# Altium schematic sheet Half_Bridges.SchDoc
size B; DocumentNumber: 6; SheetNumber: 7; SheetTotal: 7
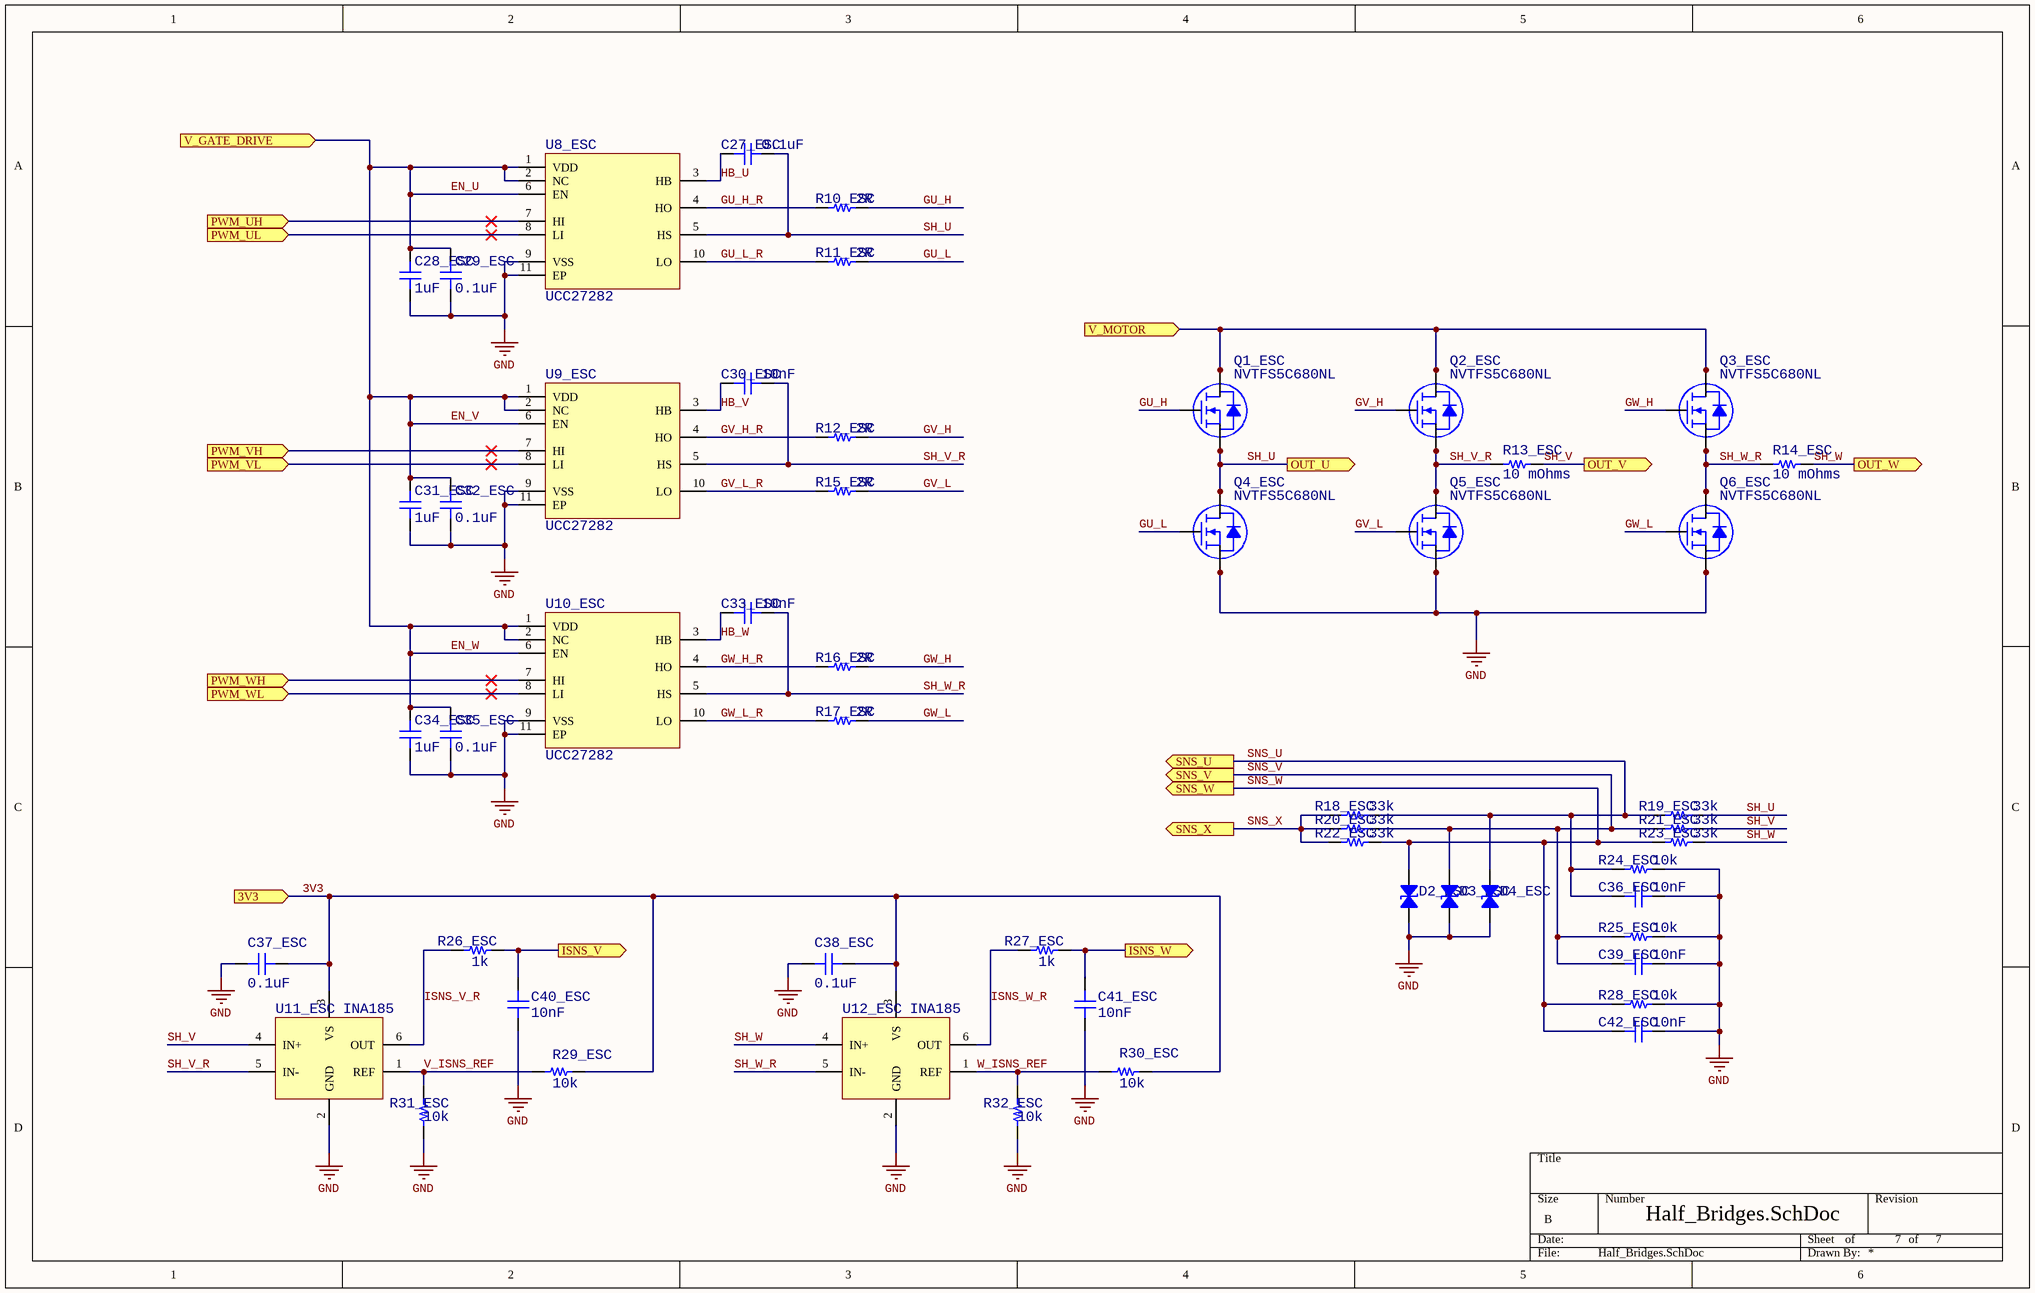
[diagram p0: Half_Bridges.SchDoc]

## Parts
C27_ESC  0.1uF  [CAP_0402]
C28_ESC  1uF  [CAP_0402]
C29_ESC  0.1uF  [CAP_0402]
C30_ESC  10nF  [CAP_0402]
C31_ESC  1uF  [CAP_0402]
C32_ESC  0.1uF  [CAP_0402]
C33_ESC  10nF  [CAP_0402]
C34_ESC  1uF  [CAP_0402]
C35_ESC  0.1uF  [CAP_0402]
C36_ESC  10nF  [CAP_0402]
C37_ESC  0.1uF  [CAP_0402]
C38_ESC  0.1uF  [CAP_0402]
C39_ESC  10nF  [CAP_0402]
C40_ESC  10nF  [CAP_0402]
C41_ESC  10nF  [CAP_0402]
C42_ESC  10nF  [CAP_0402]
D2_ESC  TVN3V3B1S-DFN1006-2LDG  [0402]  (value not drawn)
D3_ESC  TVN3V3B1S-DFN1006-2LDG  [0402]  (value not drawn)
D4_ESC  TVN3V3B1S-DFN1006-2LDG  [0402]  (value not drawn)
Q1_ESC  NVTFS5C680NL  [NVTFS015N04CTAG]
Q2_ESC  NVTFS5C680NL  [NVTFS015N04CTAG]
Q3_ESC  NVTFS5C680NL  [NVTFS015N04CTAG]
Q4_ESC  NVTFS5C680NL  [NVTFS015N04CTAG]
Q5_ESC  NVTFS5C680NL  [NVTFS015N04CTAG]
Q6_ESC  NVTFS5C680NL  [NVTFS015N04CTAG]
R10_ESC  2R  [RES_0402]
R11_ESC  2R  [RES_0402]
R12_ESC  2R  [RES_0402]
R13_ESC  10 mOhms  [RES 1206_3216]
R14_ESC  10 mOhms  [RES 1206_3216]
R15_ESC  2R  [RES_0402]
R16_ESC  2R  [RES_0402]
R17_ESC  2R  [RES_0402]
R18_ESC  33k  [RES_0402]
R19_ESC  33k  [RES_0402]
R20_ESC  33k  [RES_0402]
R21_ESC  33k  [RES_0402]
R22_ESC  33k  [RES_0402]
R23_ESC  33k  [RES_0402]
R24_ESC  10k  [RES_0402]
R25_ESC  10k  [RES_0402]
R26_ESC  1k  [RES_0402]
R27_ESC  1k  [RES_0402]
R28_ESC  10k  [RES_0402]
R29_ESC  10k  [RES_0402]
R30_ESC  10k  [RES_0402]
R31_ESC  10k  [RES_0402]
R32_ESC  10k  [RES_0402]
U8_ESC  UCC27282  [VSON-10]
U9_ESC  UCC27282  [VSON-10]
U10_ESC  UCC27282  [VSON-10]
U11_ESC  INA185  [TI SC70-6 DCK]
U12_ESC  INA185  [TI SC70-6 DCK]

## Ports
3V3 (in), ISNS_V (out), ISNS_W (out), OUT_U (out), OUT_V (out), OUT_W (out), PWM_UH (in), PWM_UL (in), PWM_VH (in), PWM_VL (in), PWM_WH (in), PWM_WL (in), SNS_U (out), SNS_V (out), SNS_W (out), SNS_X (out), V_GATE_DRIVE (in), V_MOTOR (in)

## Nets
GND: C28_ESC.2 C29_ESC.2 C31_ESC.2 C32_ESC.2 C34_ESC.2 C35_ESC.2 C36_ESC.1 C37_ESC.2 C38_ESC.2 C39_ESC.1 C40_ESC.2 C41_ESC.2 C42_ESC.1 D2_ESC.1 D3_ESC.1 D4_ESC.1 Q4_ESC.1(S) Q4_ESC.2(S) Q4_ESC.3(S) Q5_ESC.1(S) Q5_ESC.2(S) Q5_ESC.3(S) Q6_ESC.1(S) Q6_ESC.2(S) Q6_ESC.3(S) R24_ESC.2 R25_ESC.2 R28_ESC.2 R31_ESC.2 R32_ESC.2 U8_ESC.9(VSS) U8_ESC.11(EP) U9_ESC.9(VSS) U9_ESC.11(EP) U10_ESC.9(VSS) U10_ESC.11(EP) U11_ESC.2(GND) U12_ESC.2(GND)
3V3: C37_ESC.1 C38_ESC.1 R29_ESC.1 R30_ESC.1 U11_ESC.3(VS) U12_ESC.3(VS) ; port 3V3
EN_U: C28_ESC.1 C29_ESC.1 C31_ESC.1 C32_ESC.1 C34_ESC.1 C35_ESC.1 U8_ESC.1(VDD) U8_ESC.2(NC) U8_ESC.6(EN) U9_ESC.1(VDD) U9_ESC.2(NC) U9_ESC.6(EN) U10_ESC.1(VDD) U10_ESC.2(NC) U10_ESC.6(EN) ; port V_GATE_DRIVE  [also labelled EN_V, EN_W]
GU_H: Q1_ESC.4(G) R10_ESC.2
GU_H_R: R10_ESC.1 U8_ESC.4(HO)
GU_L: Q4_ESC.4(G) R11_ESC.2
GU_L_R: R11_ESC.1 U8_ESC.10(LO)
GV_H: Q2_ESC.4(G) R12_ESC.2
GV_H_R: R12_ESC.1 U9_ESC.4(HO)
GV_L: Q5_ESC.4(G) R15_ESC.2
GV_L_R: R15_ESC.1 U9_ESC.10(LO)
GW_H: Q3_ESC.4(G) R16_ESC.2
GW_H_R: R16_ESC.1 U10_ESC.4(HO)
GW_L: Q6_ESC.4(G) R17_ESC.2
GW_L_R: R17_ESC.1 U10_ESC.10(LO)
HB_U: C27_ESC.2 U8_ESC.3(HB)
HB_V: C30_ESC.2 U9_ESC.3(HB)
HB_W: C33_ESC.2 U10_ESC.3(HB)
ISNS_V: C40_ESC.1 R26_ESC.1 ; port ISNS_V
ISNS_V_R: R26_ESC.2 U11_ESC.6(OUT)
ISNS_W: C41_ESC.1 R27_ESC.1 ; port ISNS_W
ISNS_W_R: R27_ESC.2 U12_ESC.6(OUT)
PWM_UH: U8_ESC.7(HI) ; port PWM_UH
PWM_UL: U8_ESC.8(LI) ; port PWM_UL
PWM_VH: U9_ESC.7(HI) ; port PWM_VH
PWM_VL: U9_ESC.8(LI) ; port PWM_VL
PWM_WH: U10_ESC.7(HI) ; port PWM_WH
PWM_WL: U10_ESC.8(LI) ; port PWM_WL
SH_U: C27_ESC.1 Q1_ESC.1(S) Q1_ESC.2(S) Q1_ESC.3(S) Q4_ESC.5(D) Q4_ESC.6(D) Q4_ESC.7(D) Q4_ESC.8(D) R19_ESC.1 U8_ESC.5(HS) ; port OUT_U
SH_V: R13_ESC.2 R21_ESC.1 U11_ESC.4(IN+) ; port OUT_V
SH_V_R: C30_ESC.1 Q2_ESC.1(S) Q2_ESC.2(S) Q2_ESC.3(S) Q5_ESC.5(D) Q5_ESC.6(D) Q5_ESC.7(D) Q5_ESC.8(D) R13_ESC.1 U9_ESC.5(HS) U11_ESC.5(IN-)
SH_W: R14_ESC.2 R23_ESC.1 U12_ESC.4(IN+) ; port OUT_W
SH_W_R: C33_ESC.1 Q3_ESC.1(S) Q3_ESC.2(S) Q3_ESC.3(S) Q6_ESC.5(D) Q6_ESC.6(D) Q6_ESC.7(D) Q6_ESC.8(D) R14_ESC.1 U10_ESC.5(HS) U12_ESC.5(IN-)
SNS_U: C36_ESC.2 D4_ESC.2 R18_ESC.1 R19_ESC.2 R24_ESC.1 ; port SNS_U
SNS_V: C39_ESC.2 D3_ESC.2 R20_ESC.1 R21_ESC.2 R25_ESC.1 ; port SNS_V
SNS_W: C42_ESC.2 D2_ESC.2 R22_ESC.1 R23_ESC.2 R28_ESC.1 ; port SNS_W
SNS_X: R18_ESC.2 R20_ESC.2 R22_ESC.2 ; port SNS_X
V_ISNS_REF: R29_ESC.2 R31_ESC.1 U11_ESC.1(REF)
V_MOTOR: Q1_ESC.5(D) Q1_ESC.6(D) Q1_ESC.7(D) Q1_ESC.8(D) Q2_ESC.5(D) Q2_ESC.6(D) Q2_ESC.7(D) Q2_ESC.8(D) Q3_ESC.5(D) Q3_ESC.6(D) Q3_ESC.7(D) Q3_ESC.8(D) ; port V_MOTOR
W_ISNS_REF: R30_ESC.2 R32_ESC.1 U12_ESC.1(REF)

## Notes on the sheet
- of

## Library data of the parts
C27_ESC C28_ESC C29_ESC C30_ESC C31_ESC C32_ESC C33_ESC C34_ESC C35_ESC C36_ESC C37_ESC C38_ESC C39_ESC C40_ESC C41_ESC C42_ESC = CAP_0402: CAP CER 402
  C27_ESC C29_ESC C32_ESC C35_ESC C37_ESC C38_ESC: Value: 0.1uF
  C28_ESC C31_ESC C34_ESC: Value: 1uF
  C30_ESC C33_ESC C36_ESC C39_ESC C40_ESC C41_ESC C42_ESC: Value: 10nF
D2_ESC D3_ESC D4_ESC = TVN3V3B1S-DFN1006-2LDG: TVS DIODE 3.3V 14.2PF DFN1006; Manufacturer: INPAQ Technology Co., Ltd; Bidirectional Channels: 1; Capacitance @ Frequency: 11.5pF @ 1MHz; Current - Peak Pulse (10/1000µs): 8A (8/20µs); Power Line Protection: No; Type: Zener; Voltage - Breakdown (Min): 4V; Voltage - Clamping (Max) @ Ipp: 6.6V (Typ); Voltage - Reverse Standoff (Typ): 3.3V (Max); Part Number: TVN3V3B1S-DFN1006-2LDG; Applications: General Purpose; ComponentLink1Description: Datasheet; ComponentLink1URL: https://mm.digikey.com/Volume0/opasdata/d220001/medias/docus/5383/TVN3V3B1S-DFN1006-2LDG.pdf; ComponentLink2Description: DigiKey Link; ComponentLink2URL: https://www.digikey.com/en/products/detail/inpaq-technology-co-ltd/TVN3V3B1S-DFN1006-2LDG/20486686; Device Package: 0402 (1005 Metric); LastUpdated: 6/3/2024 8:22:57 PM; Lifecycle Status: Active; Minimum Order: 1; Mounting Type: Surface Mount; Operating Temperature: 150°C (TJ); Package / Case: 0402 (1005 Metric); Packaging: TapeAndReel; PartId: 11821; Price: 0.02; Series: TVN; Supplier 1: DigiKey; Supplier Part Number 1: 3526-TVN3V3B1S-DFN1006-2LDGCT-ND; Supplier Device Package: DFN1006
Q1_ESC Q2_ESC Q3_ESC Q4_ESC Q5_ESC Q6_ESC = NVTFS5C680NL: N-FET
R10_ESC R11_ESC R12_ESC R15_ESC R16_ESC R17_ESC R18_ESC R19_ESC R20_ESC R21_ESC R22_ESC R23_ESC R24_ESC R25_ESC R26_ESC R27_ESC R28_ESC R29_ESC R30_ESC R31_ESC R32_ESC = RES_0402: RES 0402
R13_ESC R14_ESC = KRL1632E-M-R039-F-T5: RES 0.039 OHM 1% 3/4W 1206; Manufacturer: Susumu; Power (Watts): 0.75W, 3/4W; Resistance: 39 mOhms; Temperature Coefficient: ±50ppm/°C; Value: 39 mOhms; Part Number: KRL1632E-M-R039-F-T5; ComponentLink1Description: Datasheet; ComponentLink1URL: http://www.susumu.co.jp/common/pdf/n_catalog_partition09_en.pdf; ComponentLink2Description: DigiKey Link; ComponentLink2URL: https://www.digikey.com/en/products/detail/susumu/KRL1632E-M-R039-F-T5/3738003; Composition: Metal Foil; Device Package: 1206 (3216 Metric); Features: Automotive AEC-Q200, Current Sense; Height - Seated (Max): 0.028" (0.70mm); LastUpdated: 2/9/2024 8:54:46 PM; Lifecycle Status: Active; Minimum Order: 1; Number of Terminations: 2; Operating Temperature: -55°C ~ 155°C; Package / Case: 1206 (3216 Metric); Packaging: TapeAndReel; PartId: 26838; Part Status: Active; Price: 0.09; Ratings: AEC-Q200; Series: KRL; Size / Dimension: 0.126" L x 0.063" W (3.20mm x 1.60mm); Supplier 1: DigiKey; Supplier Part Number 1: 408-1577-1-ND; Supplier Device Package: 1206; Tolerance: ±1%
U8_ESC U9_ESC U10_ESC = UCC27282DRCR: 3-A, 120-V half bridge gate driver with 5-V UVLO, interlock and enable 10-VSON -40 to 125; MF: Texas Instruments; Texas_Instruments-Purchase-URL: https://snapeda.com/shop?store=Texas+Instruments&id=3625400; Price: None; Availability: Warning; Package: VSON-10 Texas Instruments; SnapEDA_Link: https://www.snapeda.com/parts/UCC27282DRCR/Texas%20Instruments/view-part/3625400/?ref=snap; DigiKey-Purchase-URL: https://snapeda.com/shop?store=DigiKey&id=3625400; MP: UCC27282DRCR; Value: *
U11_ESC U12_ESC = INA185: INA185A2